# Altium schematic sheet AD_1_V1_01.SchDoc
size A2; Date: Date; CompanyName: HESSO; Engineer: Name; Address1: Route du Rawyl 47; Address2: 1950 Sion; Address3: Switzerland; DocumentNumber: 2; SheetNumber: 2; SheetTotal: 6; ProjectName: Project Name
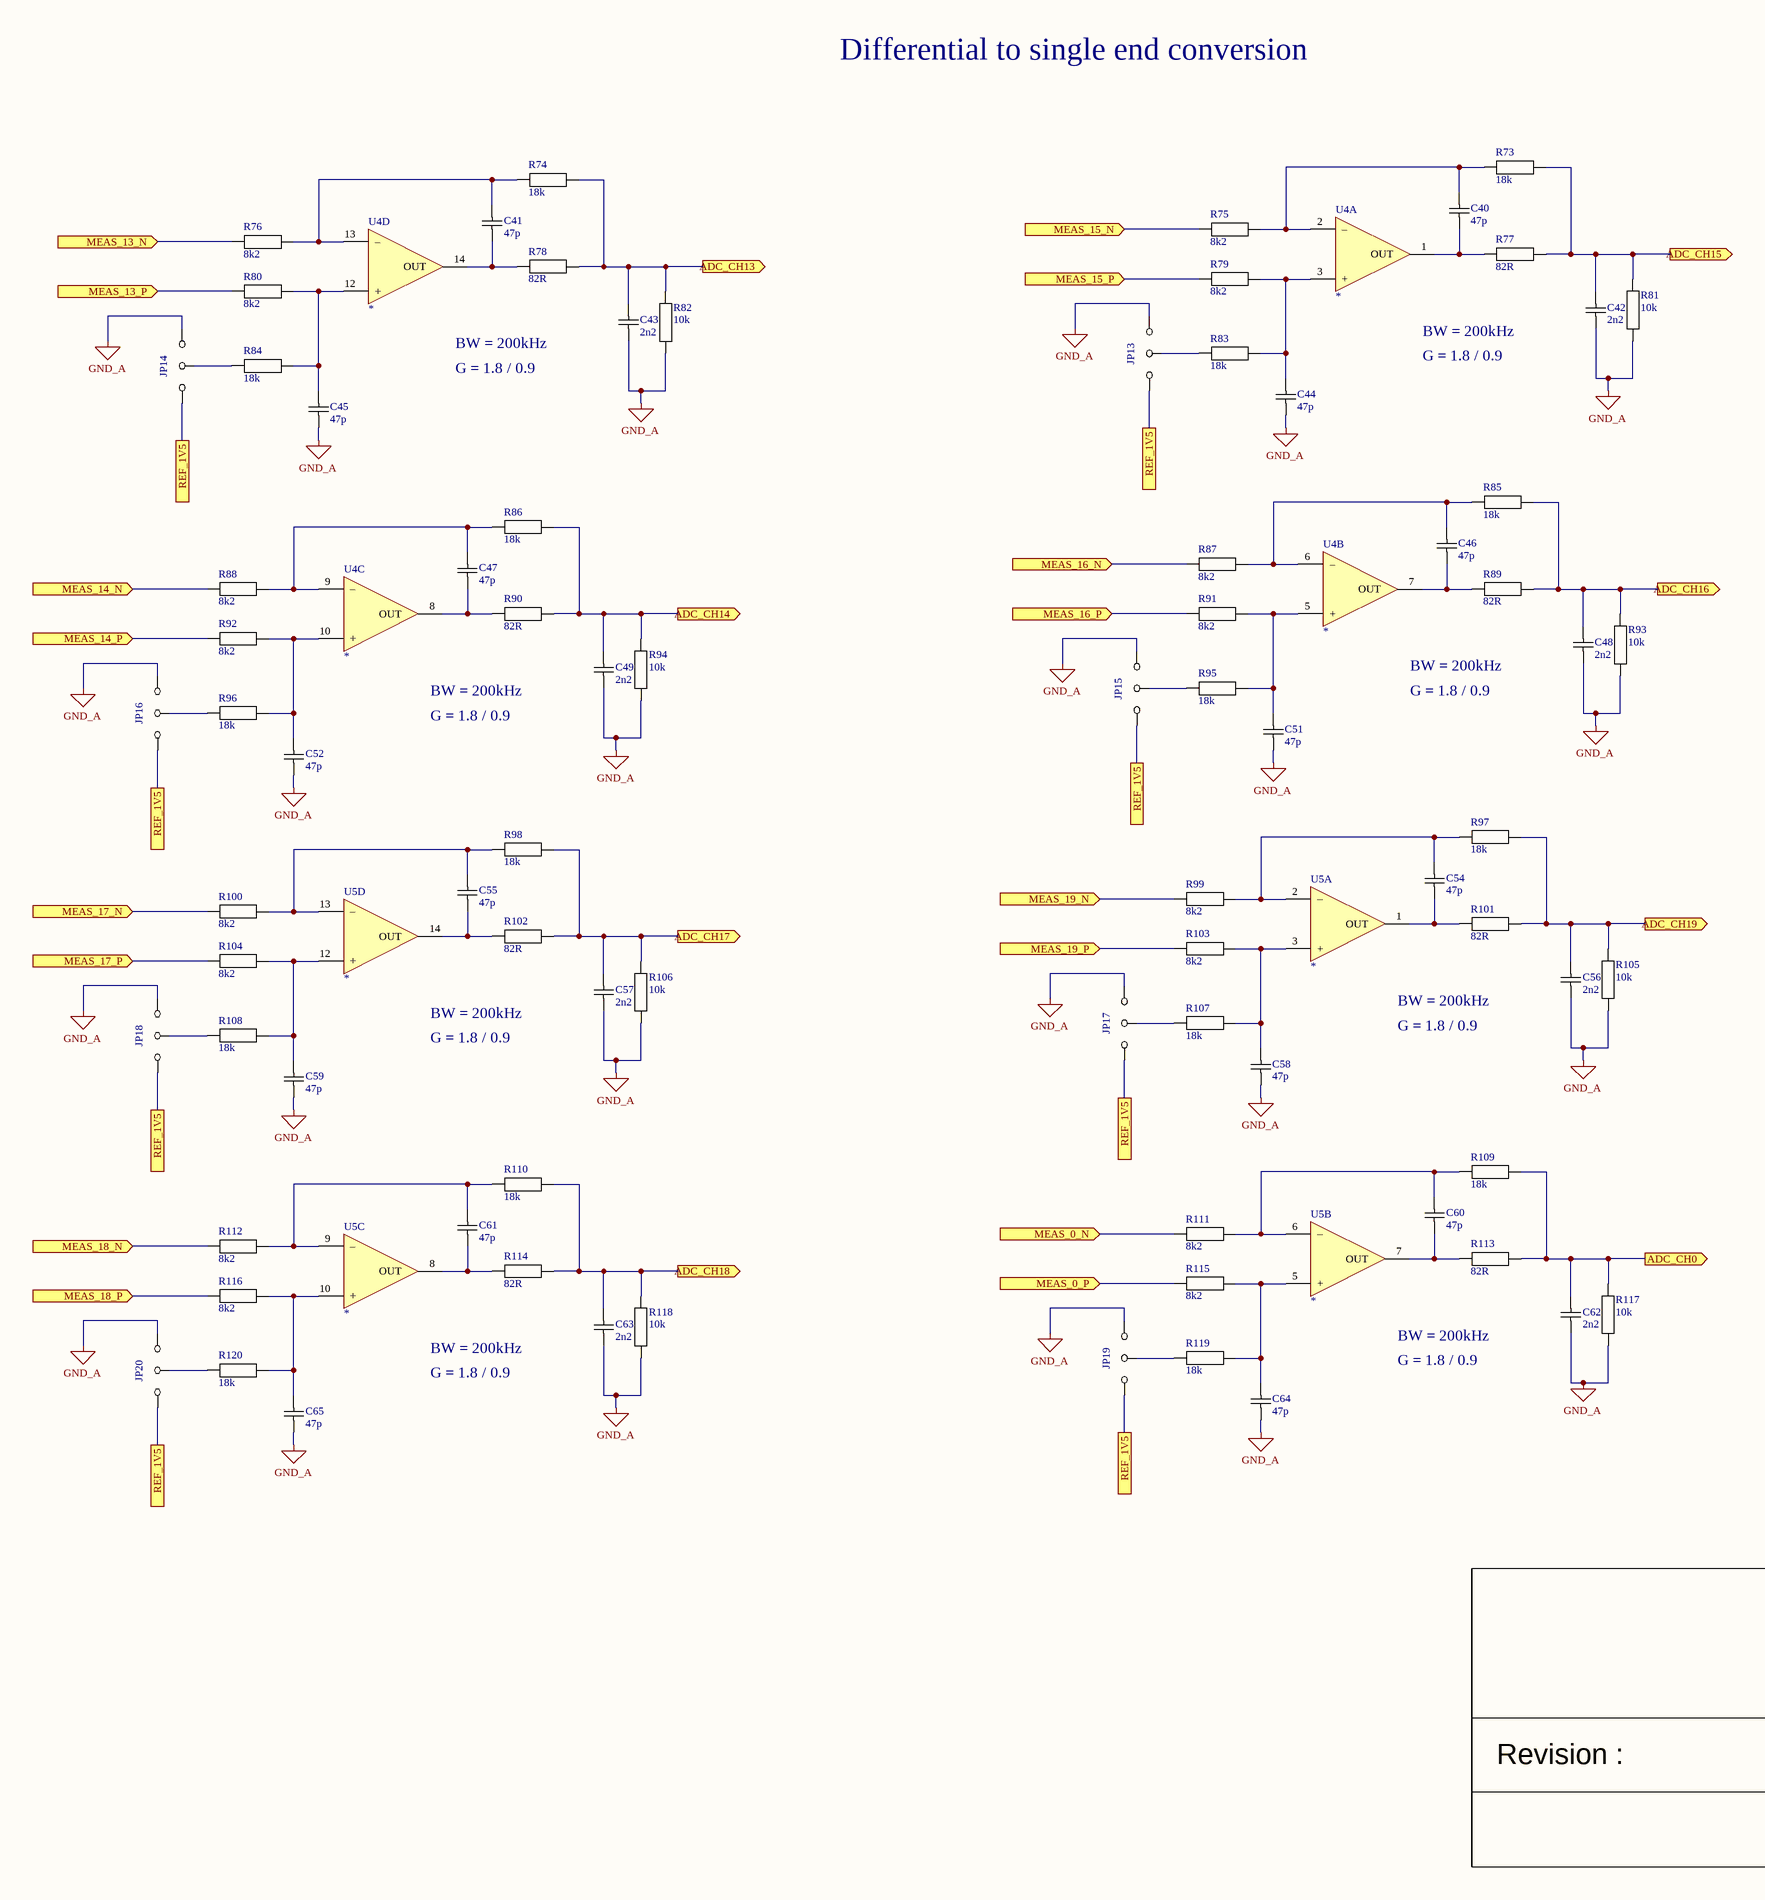
[diagram p0: AD_1_V1_01.SchDoc, left]
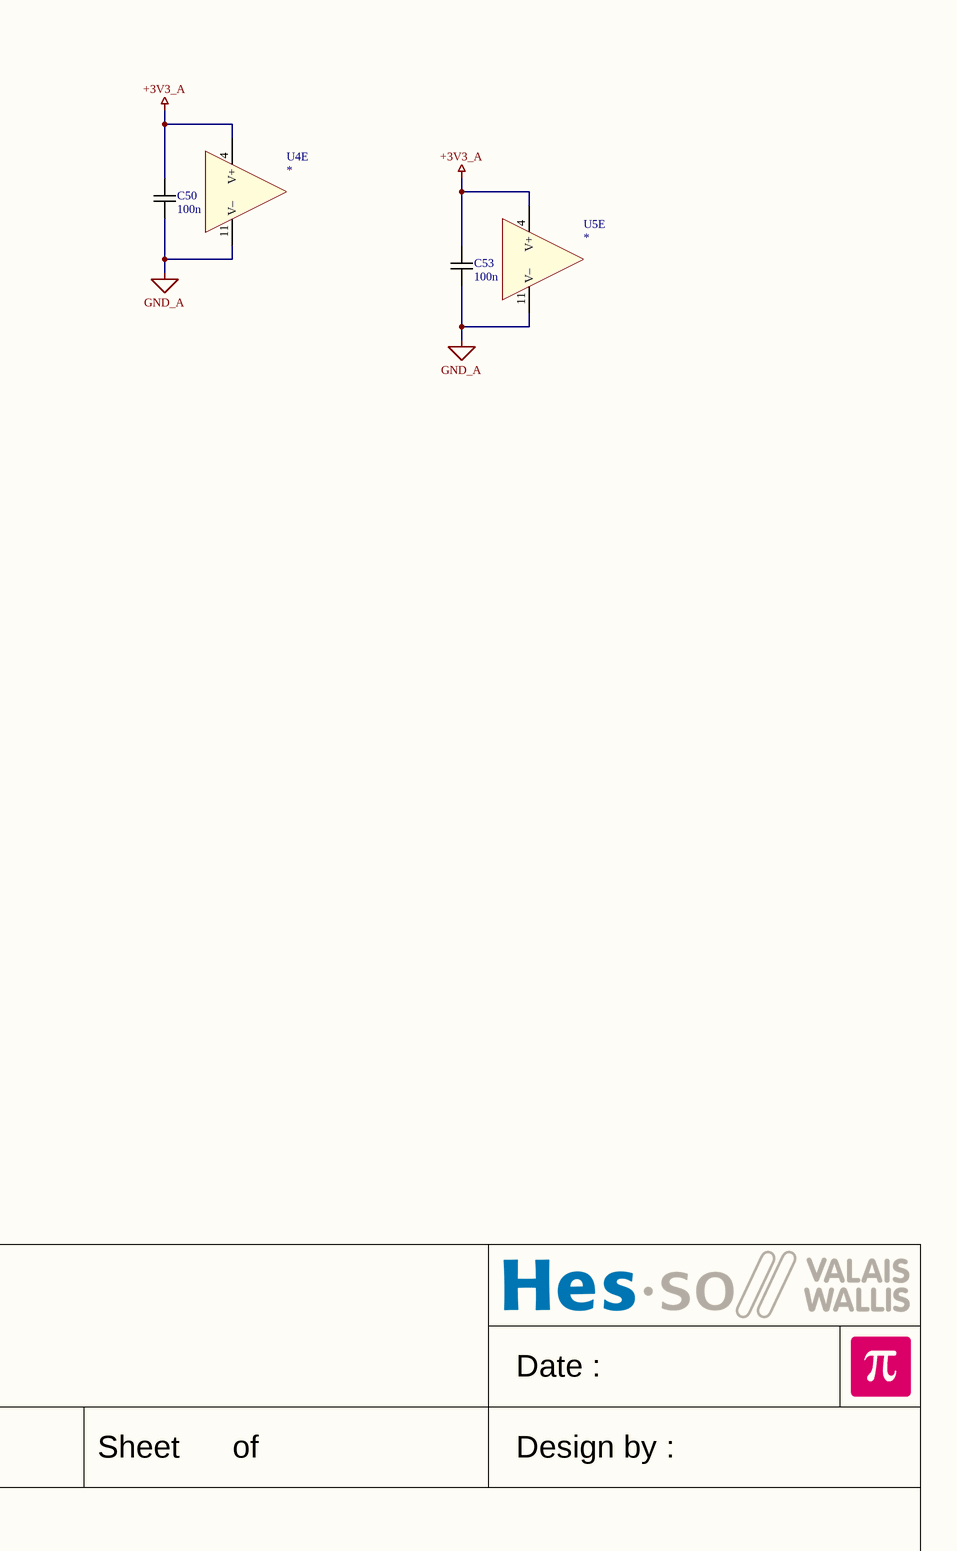
[diagram p1: AD_1_V1_01.SchDoc, right]

## Parts
C40  47p  [CAPACITOR 1608 REFLOW]
C41  47p  [CAPACITOR 1608 REFLOW]
C42  2n2  [CAPACITOR 1608 REFLOW]
C43  2n2  [CAPACITOR 1608 REFLOW]
C44  47p  [CAPACITOR 1608 REFLOW]
C45  47p  [CAPACITOR 1608 REFLOW]
C46  47p  [CAPACITOR 1608 REFLOW]
C47  47p  [CAPACITOR 1608 REFLOW]
C48  2n2  [CAPACITOR 1608 REFLOW]
C49  2n2  [CAPACITOR 1608 REFLOW]
C50  100n  [CAPACITOR 1608 REFLOW]
C51  47p  [CAPACITOR 1608 REFLOW]
C52  47p  [CAPACITOR 1608 REFLOW]
C53  100n  [CAPACITOR 1608 REFLOW]
C54  47p  [CAPACITOR 1608 REFLOW]
C55  47p  [CAPACITOR 1608 REFLOW]
C56  2n2  [CAPACITOR 1608 REFLOW]
C57  2n2  [CAPACITOR 1608 REFLOW]
C58  47p  [CAPACITOR 1608 REFLOW]
C59  47p  [CAPACITOR 1608 REFLOW]
C60  47p  [CAPACITOR 1608 REFLOW]
C61  47p  [CAPACITOR 1608 REFLOW]
C62  2n2  [CAPACITOR 1608 REFLOW]
C63  2n2  [CAPACITOR 1608 REFLOW]
C64  47p  [CAPACITOR 1608 REFLOW]
C65  47p  [CAPACITOR 1608 REFLOW]
JP13  {Value}  [JUMPER3 SMD 1608]  (value not drawn)
JP14  {Value}  [JUMPER3 SMD 1608]  (value not drawn)
JP15  {Value}  [JUMPER3 SMD 1608]  (value not drawn)
JP16  {Value}  [JUMPER3 SMD 1608]  (value not drawn)
JP17  {Value}  [JUMPER3 SMD 1608]  (value not drawn)
JP18  {Value}  [JUMPER3 SMD 1608]  (value not drawn)
JP19  {Value}  [JUMPER3 SMD 1608]  (value not drawn)
JP20  {Value}  [JUMPER3 SMD 1608]  (value not drawn)
R73  18k  [RESISTOR 1608 REFLOW]
R74  18k  [RESISTOR 1608 REFLOW]
R75  8k2  [RESISTOR 1608 REFLOW]
R76  8k2  [RESISTOR 1608 REFLOW]
R77  82R  [RESISTOR 1608 REFLOW]
R78  82R  [RESISTOR 1608 REFLOW]
R79  8k2  [RESISTOR 1608 REFLOW]
R80  8k2  [RESISTOR 1608 REFLOW]
R81  10k  [RESISTOR 1608 REFLOW]
R82  10k  [RESISTOR 1608 REFLOW]
R83  18k  [RESISTOR 1608 REFLOW]
R84  18k  [RESISTOR 1608 REFLOW]
R85  18k  [RESISTOR 1608 REFLOW]
R86  18k  [RESISTOR 1608 REFLOW]
R87  8k2  [RESISTOR 1608 REFLOW]
R88  8k2  [RESISTOR 1608 REFLOW]
R89  82R  [RESISTOR 1608 REFLOW]
R90  82R  [RESISTOR 1608 REFLOW]
R91  8k2  [RESISTOR 1608 REFLOW]
R92  8k2  [RESISTOR 1608 REFLOW]
R93  10k  [RESISTOR 1608 REFLOW]
R94  10k  [RESISTOR 1608 REFLOW]
R95  18k  [RESISTOR 1608 REFLOW]
R96  18k  [RESISTOR 1608 REFLOW]
R97  18k  [RESISTOR 1608 REFLOW]
R98  18k  [RESISTOR 1608 REFLOW]
R99  8k2  [RESISTOR 1608 REFLOW]
R100  8k2  [RESISTOR 1608 REFLOW]
R101  82R  [RESISTOR 1608 REFLOW]
R102  82R  [RESISTOR 1608 REFLOW]
R103  8k2  [RESISTOR 1608 REFLOW]
R104  8k2  [RESISTOR 1608 REFLOW]
R105  10k  [RESISTOR 1608 REFLOW]
R106  10k  [RESISTOR 1608 REFLOW]
R107  18k  [RESISTOR 1608 REFLOW]
R108  18k  [RESISTOR 1608 REFLOW]
R109  18k  [RESISTOR 1608 REFLOW]
R110  18k  [RESISTOR 1608 REFLOW]
R111  8k2  [RESISTOR 1608 REFLOW]
R112  8k2  [RESISTOR 1608 REFLOW]
R113  82R  [RESISTOR 1608 REFLOW]
R114  82R  [RESISTOR 1608 REFLOW]
R115  8k2  [RESISTOR 1608 REFLOW]
R116  8k2  [RESISTOR 1608 REFLOW]
R117  10k  [RESISTOR 1608 REFLOW]
R118  10k  [RESISTOR 1608 REFLOW]
R119  18k  [RESISTOR 1608 REFLOW]
R120  18k  [RESISTOR 1608 REFLOW]
U4  *  [SO14 P1.27 C4.0X8.8 H1.75]  (parts A,B,C,D,E of 5)
U5  *  [SO14 P1.27 C4.0X8.8 H1.75]  (parts A,B,C,D,E of 5)

## Ports
ADC_CH0 (out), ADC_CH13 (out), ADC_CH14 (out), ADC_CH15 (out), ADC_CH16 (out), ADC_CH17 (out), ADC_CH18 (out), ADC_CH19 (out), MEAS_0_N (in), MEAS_0_P (in), MEAS_13_N (in), MEAS_13_P (in), MEAS_14_N (in), MEAS_14_P (in), MEAS_15_N (in), MEAS_15_P (in), MEAS_16_N (in), MEAS_16_P (in), MEAS_17_N (in), MEAS_17_P (in), MEAS_18_N (in), MEAS_18_P (in), MEAS_19_N (in), MEAS_19_P (in), REF_1V5

## Nets
+3V3_A: C50.2 C53.2 U4.4(V+) U5.4(V+)
GND_A: C42.1 C43.1 C44.1 C45.1 C48.1 C49.1 C50.1 C51.1 C52.1 C53.1 C56.1 C57.1 C58.1 C59.1 C62.1 C63.1 C64.1 C65.1 JP13.3 JP14.3 JP15.3 JP16.3 JP17.3 JP18.3 JP19.3 JP20.3 R81.2 R82.2 R93.2 R94.2 R105.2 R106.2 R117.2 R118.2 U4.11(V–) U5.11(V–)
ADC_CH0: C62.2 R109.2 R113.2 R117.1 ; port ADC_CH0
ADC_CH13: C43.2 R74.2 R78.2 R82.1 ; port ADC_CH13
ADC_CH14: C49.2 R86.2 R90.2 R94.1 ; port ADC_CH14
ADC_CH15: C42.2 R73.2 R77.2 R81.1 ; port ADC_CH15
ADC_CH16: C48.2 R85.2 R89.2 R93.1 ; port ADC_CH16
ADC_CH17: C57.2 R98.2 R102.2 R106.1 ; port ADC_CH17
ADC_CH18: C63.2 R110.2 R114.2 R118.1 ; port ADC_CH18
ADC_CH19: C56.2 R97.2 R101.2 R105.1 ; port ADC_CH19
MEAS_0_N: R111.1 ; port MEAS_0_N
MEAS_0_P: R115.1 ; port MEAS_0_P
MEAS_13_N: R76.1 ; port MEAS_13_N
MEAS_13_P: R80.1 ; port MEAS_13_P
MEAS_14_N: R88.1 ; port MEAS_14_N
MEAS_14_P: R92.1 ; port MEAS_14_P
MEAS_15_N: R75.1 ; port MEAS_15_N
MEAS_15_P: R79.1 ; port MEAS_15_P
MEAS_16_N: R87.1 ; port MEAS_16_N
MEAS_16_P: R91.1 ; port MEAS_16_P
MEAS_17_N: R100.1 ; port MEAS_17_N
MEAS_17_P: R104.1 ; port MEAS_17_P
MEAS_18_N: R112.1 ; port MEAS_18_N
MEAS_18_P: R116.1 ; port MEAS_18_P
MEAS_19_N: R99.1 ; port MEAS_19_N
MEAS_19_P: R103.1 ; port MEAS_19_P
REF_1V5: JP13.1 JP14.1 JP15.1 JP16.1 JP17.1 JP18.1 JP19.1 JP20.1 ; port REF_1V5
NetC40_1: C40.1 R77.1 U4.1(OUT)
NetC40_2: C40.2 R73.1 R75.2 U4.2(–)
NetC41_1: C41.1 R78.1 U4.14(OUT)
NetC41_2: C41.2 R74.1 R76.2 U4.13(–)
NetC44_2: C44.2 R79.2 R83.1 U4.3(+)
NetC45_2: C45.2 R80.2 R84.1 U4.12(+)
NetC46_1: C46.1 R89.1 U4.7(OUT)
NetC46_2: C46.2 R85.1 R87.2 U4.6(–)
NetC47_1: C47.1 R90.1 U4.8(OUT)
NetC47_2: C47.2 R86.1 R88.2 U4.9(–)
NetC51_2: C51.2 R91.2 R95.1 U4.5(+)
NetC52_2: C52.2 R92.2 R96.1 U4.10(+)
NetC54_1: C54.1 R101.1 U5.1(OUT)
NetC54_2: C54.2 R97.1 R99.2 U5.2(–)
NetC55_1: C55.1 R102.1 U5.14(OUT)
NetC55_2: C55.2 R98.1 R100.2 U5.13(–)
NetC58_2: C58.2 R103.2 R107.1 U5.3(+)
NetC59_2: C59.2 R104.2 R108.1 U5.12(+)
NetC60_1: C60.1 R113.1 U5.7(OUT)
NetC60_2: C60.2 R109.1 R111.2 U5.6(–)
NetC61_1: C61.1 R114.1 U5.8(OUT)
NetC61_2: C61.2 R110.1 R112.2 U5.9(–)
NetC64_2: C64.2 R115.2 R119.1 U5.5(+)
NetC65_2: C65.2 R116.2 R120.1 U5.10(+)
NetJP13_2: JP13.2 R83.2
NetJP14_2: JP14.2 R84.2
NetJP15_2: JP15.2 R95.2
NetJP16_2: JP16.2 R96.2
NetJP17_2: JP17.2 R107.2
NetJP18_2: JP18.2 R108.2
NetJP19_2: JP19.2 R119.2
NetJP20_2: JP20.2 R120.2

## Notes on the sheet
- Differential to single end conversion
- BW = 200kHz
- G = 1.8 / 0.9
- Date :
- Revision :
- Sheet
- of
- Design by :

## Library data of the parts
C40-C65 = Capacitor: Capacitor X7R 10% 50V 1608(0603)
  C40 C41 C44-C47 C51 C52 C54 C55 C58-C61 C64 C65: Value: 47p
  C42 C43 C48 C49 C56 C57 C62 C63: Value: 2n2
  C50 C53: Value: 100n
JP13-JP20 = JUMPER 3 POS: Value: {Value}
R73-R120 = Resistor: Resistor 1% 50V 100mW 1608(0603)
  R73 R74 R83-R86 R95-R98 R107-R110 R119 R120: Value: 18k
  R75 R76 R79 R80 R87 R88 R91 R92 R99 R100 R103 R104 R111 R112 R115 R116: Value: 8k2
  R77 R78 R89 R90 R101 R102 R113 R114: Value: 82R
  R81 R82 R93 R94 R105 R106 R117 R118: Value: 10k
U4 U5 = OPA QUAD: Generic quad OPA 14 pins; Value: *